# EAGLE design tda (EAGLE 7.7.0)
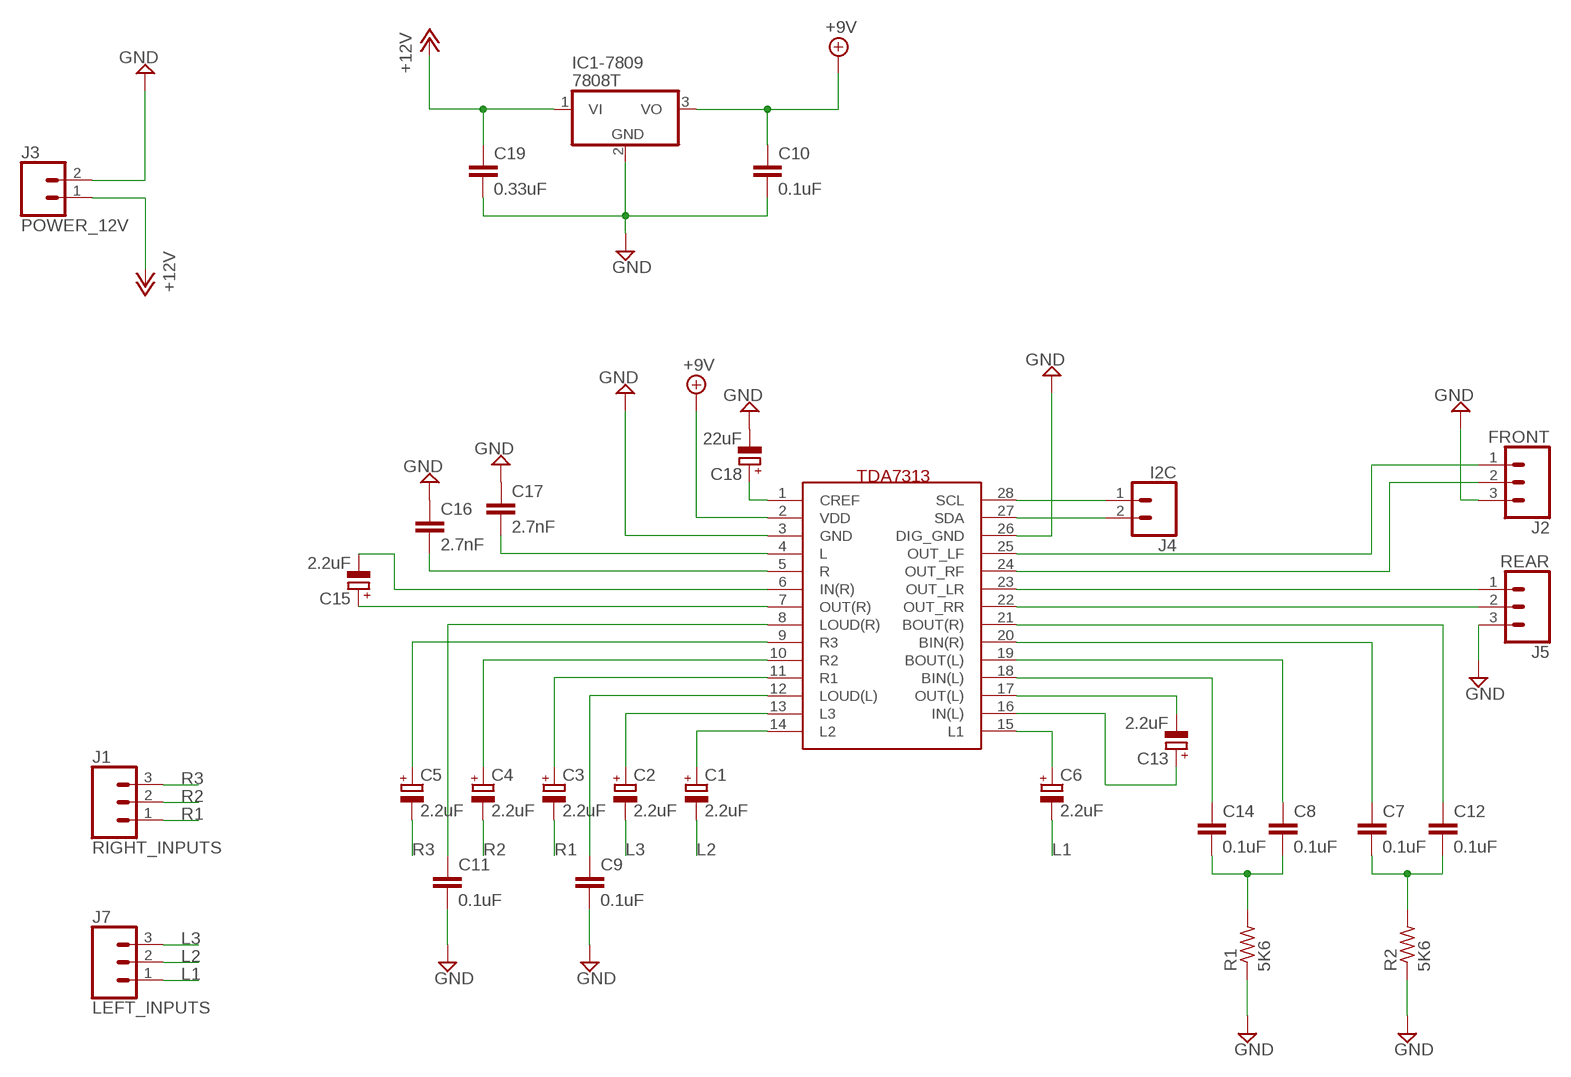
[diagram p0: schematic, sheet 1]

## Parts
C1  2.2uF  CPOL-EUE2-4  [E2-4]
C2  2.2uF  CPOL-EUE2-4  [E2-4]
C3  2.2uF  CPOL-EUE2-4  [E2-4]
C4  2.2uF  CPOL-EUE2-4  [E2-4]
C5  2.2uF  CPOL-EUE2-4  [E2-4]
C6  2.2uF  CPOL-EUE2-4  [E2-4]
C7  0.1uF  C-EUC0805  [C0805]
C8  0.1uF  C-EUC0805  [C0805]
C9  0.1uF  C-EUC0805  [C0805]
C10  0.1uF  C-EUC0805  [C0805]
C11  0.1uF  C-EUC0805  [C0805]
C12  0.1uF  C-EUC0805  [C0805]
C13  2.2uF  CPOL-EUE2-4  [E2-4]
C14  0.1uF  C-EUC0805  [C0805]
C15  2.2uF  CPOL-EUE2-4  [E2-4]
C16  2.7nF  C-EUC0805  [C0805]
C17  2.7nF  C-EUC0805  [C0805]
C18  22uF  CPOL-EUE2-4  [E2-4]
C19  0.33uF  C-EUC0805  [C0805]
IC1-7809  7808T  [TO220H]
J1  RIGHT_INPUTS  CONN_03LONGPADS  [1X03_LONGPADS]
J2  FRONT  CONN_03LONGPADS  [1X03_LONGPADS]
J3  POWER_12V  CONN_02LOCK_LONGPADS  [1X02_LOCK_LONGPADS]
J4  I2C  CONN_02LOCK_LONGPADS  [1X02_LOCK_LONGPADS]
J5  REAR  CONN_03LONGPADS  [1X03_LONGPADS]
J7  LEFT_INPUTS  CONN_03LONGPADS  [1X03_LONGPADS]
R1  5K6  R-US_0207/10  [0207/10]
R2  5K6  R-US_0207/10  [0207/10]
U$1  TDA7313_SO28  [SO28]

## Nets
+9V: C10.1 IC1-7809.3(VO) U$1.2(VDD)
+12V: C19.1 IC1-7809.1(VI) J3.1
GND: C9.2 C10.2 C11.2 C16.1 C17.1 C18.- C19.2 IC1-7809.2(GND) J2.3 J3.2 J5.3 R1.1 R2.1 U$1.3(GND) U$1.26(DIG_GND)
L1: C6.- J7.1
L2: C1.- J7.2
L3: C2.- J7.3
N$1: C1.+ U$1.14(L2)
N$2: C2.+ U$1.13(L3)
N$3: C3.+ U$1.11(R1)
N$4: C4.+ U$1.10(R2)
N$5: C5.+ U$1.9(R3)
N$6: C6.+ U$1.15(L1)
N$7: C9.1 U$1.12(LOUD(L))
N$8: C11.1 U$1.8(LOUD(R))
N$9: C13.- U$1.17(OUT(L))
N$10: C13.+ U$1.16(IN(L))
N$11: C8.2 C14.2 R1.2
N$12: C14.1 U$1.18(BIN(L))
N$13: C8.1 U$1.19(BOUT(L))
N$14: C7.2 C12.2 R2.2
N$15: C7.1 U$1.20(BIN(R))
N$16: C12.1 U$1.21(BOUT(R))
N$17: C15.+ U$1.7(OUT(R))
N$18: C15.- U$1.6(IN(R))
N$19: C16.2 U$1.5(R)
N$20: C17.2 U$1.4(L)
N$21: C18.+ U$1.1(CREF)
OUT_LF: J2.1 U$1.25(OUT_LF)
OUT_LR: J5.1 U$1.23(OUT_LR)
OUT_RF: J2.2 U$1.24(OUT_RF)
OUT_RR: J5.2 U$1.22(OUT_RR)
R1: C3.- J1.1
R2: C4.- J1.2
R3: C5.- J1.3
SCL: J4.1 U$1.28(SCL)
SDA: J4.2 U$1.27(SDA)

## Library data of the parts
C1-C6 C13 C15 C18 = resistor:CPOL-EU: POLARIZED CAPACITOR, European symbol
C7-C12 C14 C16 C17 C19 = resistor:C-EU: CAPACITOR, European symbol
IC1-7809 = adafruit:78*: Positive VOLTAGE REGULATOR Added bigger pads to the TO-92 package
J1 J2 J5 J7 = SparkFun-Connectors:CONN_03: Multi connection point. Often used as Generic Header-pin footprint for 0.1 inch spaced/style header connections On any of the 0.1 inch spaced packages, you can populate with these: Break Away Headers - Straight <https://www.sparkfun.com/products/116> (PRT-00116) Break Away Male Headers - Right Angle <https://www.sparkfun.com/products/553> (PRT-00553) Female Headers <https://www.sparkfun.com/products/115> (PRT-00115) Break Away Headers - Machine Pin <https://www.sparkfun.com/products/117> (PRT-00117) Break Away Female Headers - Swiss Machine Pin <https://www.sparkfun.com/products/743> (PRT-00743) Stackable Header - 3 Pin (Female, 0.1") <https://www.sparkfun.com/products/13875> (PRT-13875) For SCREWTERMINALS and SPRING TERMINALS visit here: Screw Terimnals on SparkFun.com <https://www.sparkfun.com/search/results?term=Screw+Terminals> (5mm/3.5mm/2.54mm spacing) This device is also useful as a general connection point to wire up your design to another part of your project. Our various solder wires solder well into these plated through hole pads. Hook-Up Wire - Assortment (Stranded, 22 AWG) <https://www.sparkfun.com/products/11375> (PRT-11375) Hook-Up Wire - Assortment (Solid Core, 22 AWG) <https://www.sparkfun.com/products/11367> (PRT-11367) View the entire wire category on our website here <https://www.sparkfun.com/categories/141> Special notes: Molex polarized connector foot print use with SKU : PRT-08232 with associated crimp pins and housings.
J3 J4 = SparkFun-Connectors:CONN_02: Multi connection point. Often used as Generic Header-pin footprint for 0.1 inch spaced/style header connections On any of the 0.1 inch spaced packages, you can populate with these: Break Away Headers - Straight <https://www.sparkfun.com/products/116> (PRT-00116) Break Away Male Headers - Right Angle <https://www.sparkfun.com/products/553> (PRT-00553) Female Headers <https://www.sparkfun.com/products/115> (PRT-00115) Break Away Headers - Machine Pin <https://www.sparkfun.com/products/117> (PRT-00117) Break Away Female Headers - Swiss Machine Pin <https://www.sparkfun.com/products/743> (PRT-00743) For SCREWTERMINALS and SPRING TERMINALS visit here: Screw Terimnals on SparkFun.com <https://www.sparkfun.com/search/results?term=Screw+Terminals> (5mm/3.5mm/2.54mm spacing) This device is also useful as a general connection point to wire up your design to another part of your project. Our various solder wires solder well into these plated through hole pads. Hook-Up Wire - Assortment (Stranded, 22 AWG) <https://www.sparkfun.com/products/11375> (PRT-11375) Hook-Up Wire - Assortment (Solid Core, 22 AWG) <https://www.sparkfun.com/products/11367> (PRT-11367) View the entire wire category on our website here <https://www.sparkfun.com/categories/141> Special notes: Molex polarized connector foot print use with: PRT-08233 with associated crimp pins and housings. 2.54_SCREWTERM for use with PRT-10571. 3.5mm Screw Terminal footprints for PRT-08084 5mm Screw Terminal footprints for use with PRT-08432
R1 R2 = resistor:R-US_: RESISTOR, American symbol
U$1 = TDA7313:TDA7313_SO28

## Board
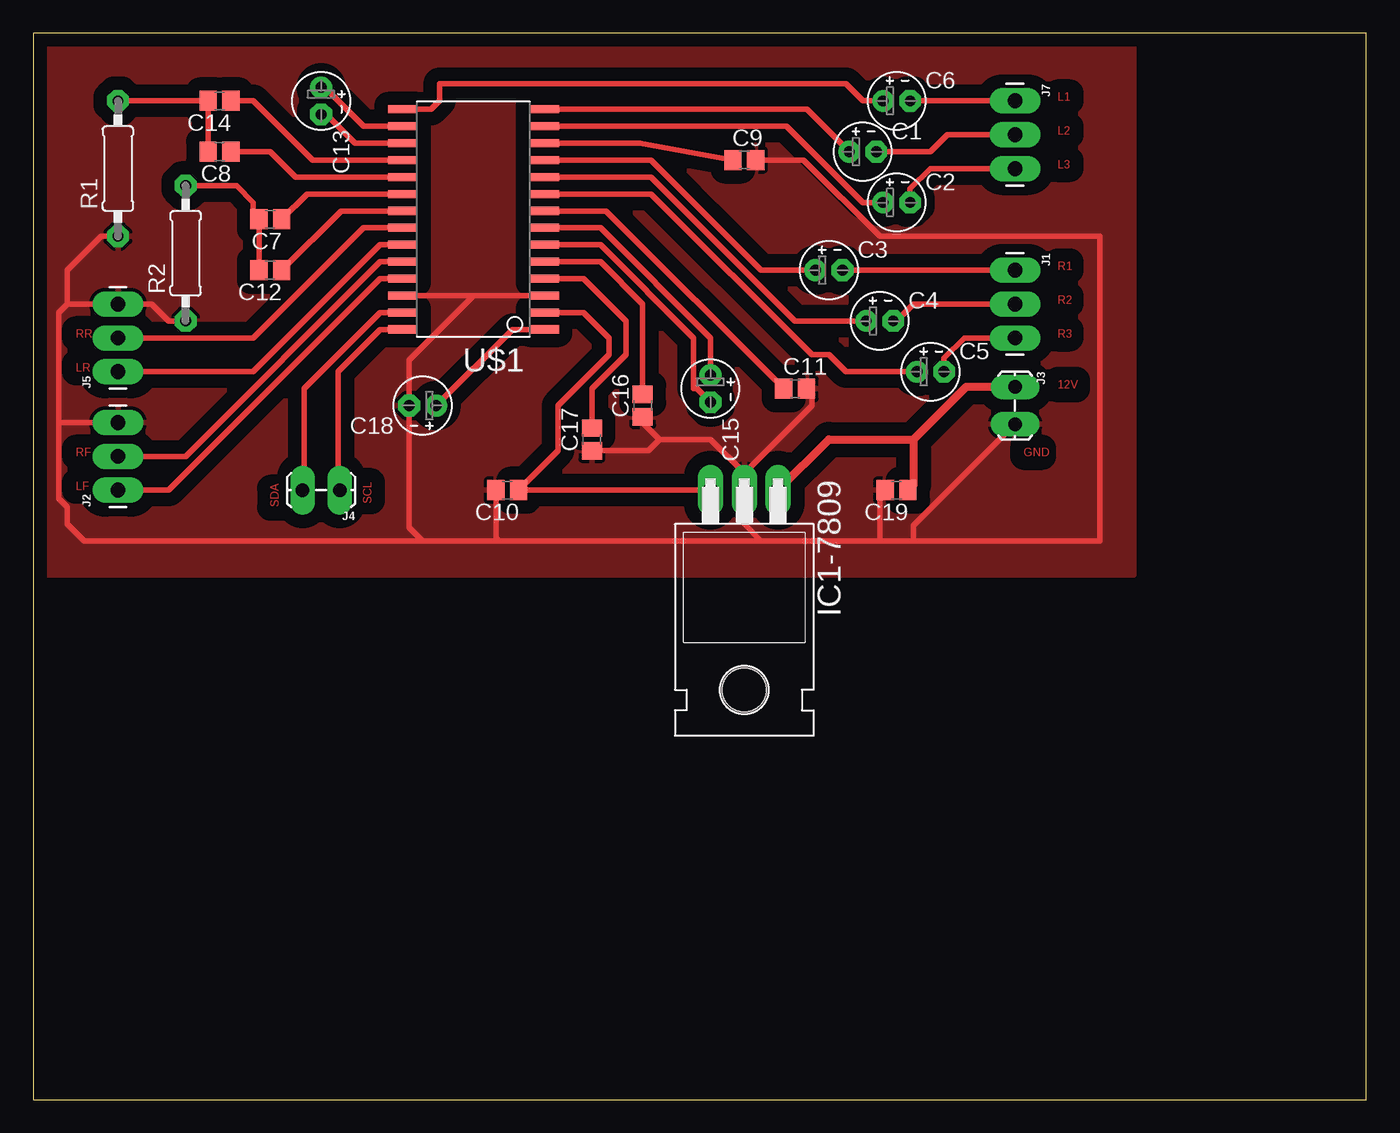
[diagram p1: board, top side]

Size 100 x 80 mm. Coordinates in mm from the lower left corner, seen from the top.
Outline: 0,0 100,0 100,80 0,80 0,0
Copper layers (1*16): Top 0.035mm / dielectric 1.5mm / Bottom 0.035mm
Design rules "SparkFun *": minimum track width 8mil, minimum drill 20mil, track to track 8mil, track to pad 8mil, pad to pad 8mil, via to via 8mil, smd to smd 8mil, copper to edge 10mil, drill to drill 8mil, minimum pad ring 16mil, minimum via ring 8mil, stop-mask expansion 4mil, vias tented up to drill 25mil, thermal gap 10mil

### Footprints (pad centres in the part's own frame; a part is rotated, then mirrored left to right if it is on the bottom)
E2-4 = drill 0.813 pad 1.27: + -1.016,0 | drill 0.813 pad 1.27 octagon: - 1.016,0
C0805 = smd 1.3 x 1.5: 1 -0.85,0; 2 0.85,0
TO220H = drill 1.118 long: 1 -2.54,-10.16; 2 0,-10.16; 3 2.54,-10.16 | hole 3.302: 0,4.826
1X03_LONGPADS = drill 1.118 pad 1.88 long: 1 0,0; 2 2.54,0; 3 5.08,0
1X02_LOCK_LONGPADS = drill 1.016 long: 1 -0.127,0; 2 2.667,0
0207/10 = drill 0.813 octagon: 1 -5.08,0; 2 5.08,0
SO28 = smd 0.61 x 2.21: 1 -8.255,-5.315; 2 -6.985,-5.315; 3 -5.715,-5.315; 4 -4.445,-5.315; 5 -3.175,-5.315; 6 -1.905,-5.315; 7 -0.635,-5.315; 8 0.635,-5.315; 9 1.905,-5.315; 10 3.175,-5.315; 11 4.445,-5.315; 12 5.715,-5.315; 13 6.985,-5.315; 14 8.255,-5.315; 15 8.255,5.315; 16 6.985,5.315; 17 5.715,5.315; 18 4.445,5.315; 19 3.175,5.315; 20 1.905,5.315; 21 0.635,5.315; 22 -0.635,5.315; 23 -1.905,5.315; 24 -3.175,5.315; 25 -4.445,5.315; 26 -5.715,5.315; 27 -6.985,5.315; 28 -8.255,5.315

### Placement (x,y rotation side)
C1  62.23,71.12 0 top
C2  64.77,67.31 0 top
C3  59.69,62.23 0 top
C4  63.5,58.42 0 top
C5  67.31,54.61 0 top
C6  64.77,74.93 0 top
C7  17.78,66.04 180 top
C8  13.97,71.12 180 top
C9  53.34,70.48 0 top
C10  35.56,45.72 180 top
C11  57.15,53.34 0 top
C12  17.78,62.23 180 top
C13  21.59,74.93 270 top
C14  13.97,74.93 180 top
C15  50.8,53.34 270 top
C16  45.72,52.07 90 top
C17  41.91,49.53 90 top
C18  29.21,52.07 180 top
C19  64.77,45.72 180 top
IC1-7809  53.34,35.56 180 top
J1  73.66,62.23 270 top
J2  6.35,45.72 90 top
J3  73.66,53.34 270 top
J4  22.86,45.72 180 top
J5  6.35,54.61 90 top
J7  73.66,74.93 270 top
R1  6.35,69.85 90 top
R2  11.43,63.5 90 top
U$1  33.02,66.04 90 top

### Tracks (layer width: path | path; a pad name or v marks a point on that pad's centre or on a via)
+9V
  Top 0.406: U$1.2 41.27,59.05 43.18,57.15 43.18,55.88 39.37,52.07 39.37,48.68 C10.1 IC1-7809.3
+12V
  Top 0.406: 66.04,46.14 C19.1
  Top 0.61: 66.04,49.53 66.04,46.14 | IC1-7809.1 59.69,49.53 66.04,49.53 | J3.1 69.98,53.47 66.04,49.53
GND
  Top 0.406: U$1.26 33.02,60.33 | 33.02,60.33 U$1.3 | 66.04,41.91 63.5,41.91 | 63.5,41.91 54.61,41.91 | 54.61,41.91 53.34,43.18 IC1-7809.2 53.34,46.99 | C19.2 63.5,45.3 63.5,41.91 | 33.02,60.33 28.19,55.5 C18.- 28.19,42.93 29.21,41.91 | 34.92,41.91 54.61,41.91 | R2.1 10.16,58.42 8.89,59.69 J5.3 2.54,59.69 | 29.21,41.91 3.81,41.91 2.54,43.18 2.54,44.45 1.91,45.09 1.91,50.8 | 29.21,41.91 34.92,41.91 | J2.3 1.91,50.8 | R1.1 5.08,64.77 2.54,62.23 2.54,59.69 | 53.34,46.99 58.42,52.07 58.42,52.92 C11.2 | C16.1 45.72,50.8 46.99,49.53 | 46.99,49.53 50.8,49.53 53.34,46.99 | C17.1 46.14,48.68 46.99,49.53 | 66.04,41.91 66.04,43.05 J3.2 | C9.2 57.78,70.48 63.5,64.77 80.01,64.77 80.01,41.91 66.04,41.91 | 1.91,50.8 1.91,59.05 2.54,59.69 | C10.2 34.71,42.12 34.92,41.91
  pour Top (isolate 1.016): 0,80.01 0,39.37 82.55,39.37 82.55,80.01
L1
  Top 0.406: C6.- J7.1
L2
  Top 0.406: C1.- 67.31,71.12 68.58,72.39 J7.2
L3
  Top 0.406: C2.- 65.79,68.33 67.31,69.85 J7.3
N$1
  Top 0.406: U$1.14 58.04,74.3 C1.+
N$2
  Top 0.406: U$1.13 56.52,73.03 62.23,67.31 C2.+
N$3
  Top 0.406: U$1.11 46.35,70.48 54.61,62.23 C3.+
N$4
  Top 0.406: U$1.10 46.35,69.22 57.15,58.42 C4.+
N$5
  Top 0.406: U$1.9 46.35,67.94 58.42,55.88 59.69,55.88 60.96,54.61 C5.+
N$6
  Top 0.406: U$1.15 29.84,74.3 30.48,74.93 30.48,76.2 60.96,76.2 62.23,74.93 C6.+
N$7
  Top 0.406: U$1.12 45.51,71.75 C9.1
N$8
  Top 0.406: U$1.8 42.97,66.67 C11.1
N$9
  Top 0.406: C13.- 21.97,73.91 24.13,71.75 U$1.17
N$10
  Top 0.406: U$1.16 24.77,73.03 21.59,76.2 C13.+
N$11
  Top 0.406: R1.2 C14.2 C8.2
N$12
  Top 0.406: U$1.18 20.95,70.48 16.51,74.93 C14.1
N$13
  Top 0.406: U$1.19 19.68,69.22 17.78,71.12 C8.1
N$14
  Top 0.406: C12.2 C7.2 16.51,66.46 16.51,67.31 15.24,68.58 R2.2
N$15
  Top 0.406: U$1.20 20.54,67.94 C7.1
N$16
  Top 0.406: U$1.21 23.07,66.67 C12.1
N$17
  Top 0.406: U$1.7 42.55,65.41 50.8,57.15 C15.+
N$18
  Top 0.406: U$1.6 42.55,64.14 49.53,57.15 49.53,53.34 49.78,53.34 C15.-
N$19
  Top 0.406: U$1.5 42.55,62.87 45.72,59.69 C16.2
N$20
  Top 0.406: U$1.4 41.27,61.59 44.45,58.42 44.45,55.88 41.91,53.34 C17.2
N$21
  Top 0.406: U$1.1 35.94,57.78 C18.+
N$22
  pour Top (isolate 1.016): 41.91,68.58 41.91,54.61 60.96,54.61 60.96,68.58
OUT_LF
  Top 0.406: U$1.25 26.04,61.59 10.16,45.72 J2.1
OUT_LR
  Top 0.406: U$1.23 26.04,64.14 16.51,54.61 J5.1
OUT_RF
  Top 0.406: U$1.24 26.04,62.87 11.43,48.26 J2.2
OUT_RR
  Top 0.406: U$1.22 24.77,65.41 16.51,57.15 J5.2
R1
  Top 0.406: C3.- J1.1
R2
  Top 0.406: C4.- 64.77,58.42 66.04,59.69 J1.2
R3
  Top 0.406: C5.- 68.33,55.63 69.85,57.15 J1.3
SCL
  Top 0.406: U$1.28 26.04,57.78 22.86,54.61 22.86,45.85 J4.1
SDA
  Top 0.406: U$1.27 26.04,59.05 20.32,53.34 20.32,45.85 J4.2

### Text on the board
Top: L1 | L2 | L3 | R1 | R2 | RR | R3 | LR | 12V | RF | GND | LF | SCL | SDA